# EAGLE schematic SirenController (EAGLE 7.1.0)
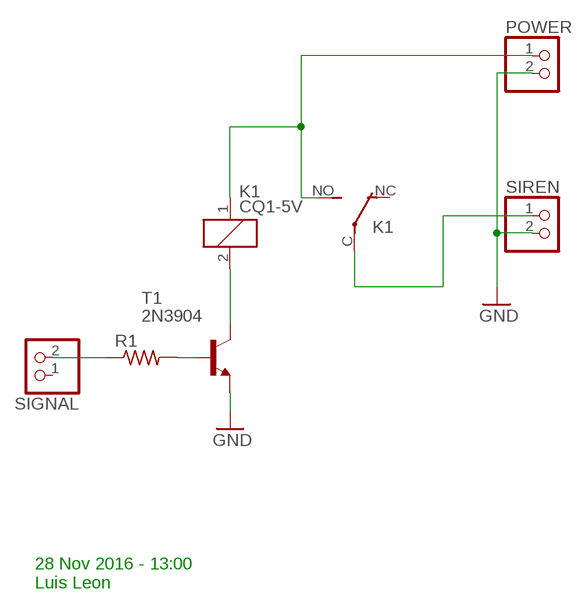
[diagram p0: schematic, sheet 1]

## Parts
K1  CQ1-5V  CQ1-12V  [CQ1]
POWER  PINHD-1X2  [1X02]
R1  R-US_0309/10  [0309/10]
SIGNAL  PINHD-1X2  [1X02]
SIREN  PINHD-1X2  [1X02]
T1  2N3904  [TO92]

## Nets
GND: POWER.2 SIREN.2 T1.3(E)
N$1: K1.C(2:P) SIREN.1
N$2: K1.1 K1.NO(2:S) POWER.1
N$3: K1.2 T1.1(C)
N$4: R1.1 SIGNAL.2
N$5: R1.2 T1.2(B)
Unconnected: K1.NC(2:O) SIGNAL.1

## Notes on the sheet
- 28 Nov 2016 - 13:00
  Luis Leon

## Library data of the parts
K1 = relay:CQ1-12V: AUTOMOTIVE QUIET RELAY NAiS Source: http://www.mew-europe.com/.. en_ds_61208_0000.pdf; OC_FARNELL: unknown; OC_NEWARK: unknown
POWER SIGNAL SIREN = pinhead:PINHD-1X2: PIN HEADER
R1 = rcl:R-US_: RESISTOR, American symbol
T1 = transistor:2N3904: NPN TRANSISTOR